# Altium schematic sheet to_sideXtal_energy.SchDoc
size A4
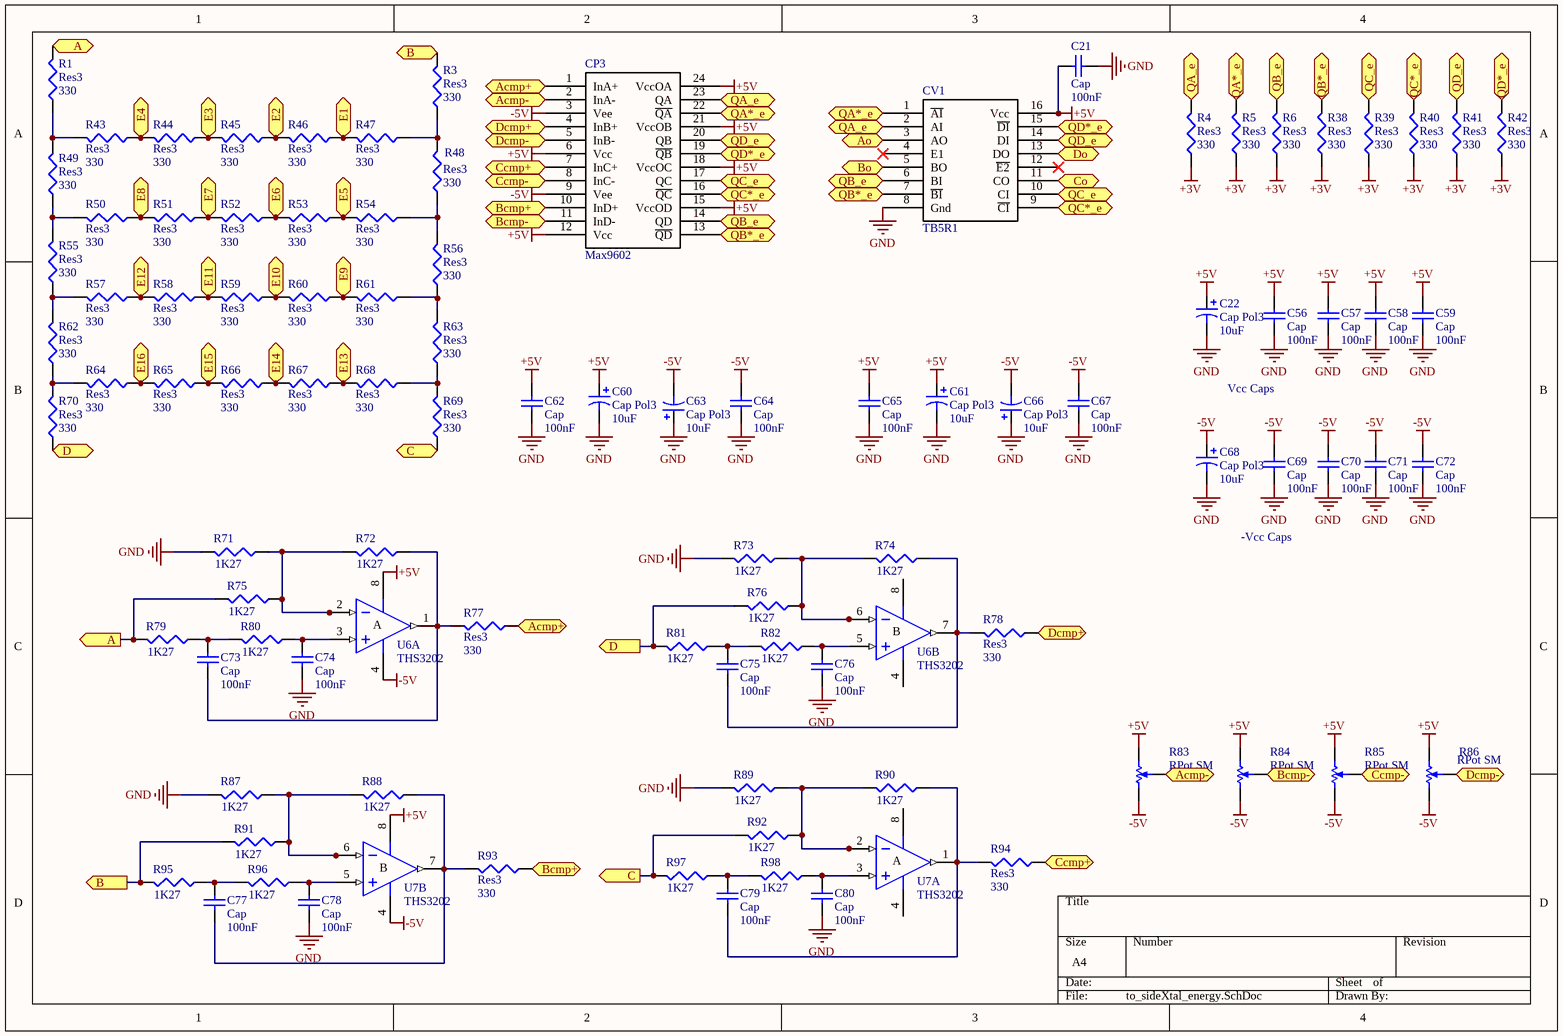
[diagram p0: to_sideXtal_energy.SchDoc]

## Parts
C21  Cap  value 100nF  [1608[0603]]
C22  Cap Pol3  value 10uF  [1608[0603]]
C56  Cap  value 100nF  [0402]
C57  Cap  value 100nF  [0402]
C58  Cap  value 100nF  [0402]
C59  Cap  value 100nF  [0402]
C60  Cap Pol3  value 10uF  [1608[0603]]
C61  Cap Pol3  value 10uF  [1608[0603]]
C62  Cap  value 100nF  [0402]
C63  Cap Pol3  value 10uF  [1608[0603]]
C64  Cap  value 100nF  [0402]
C65  Cap  value 100nF  [0402]
C66  Cap Pol3  value 10uF  [1608[0603]]
C67  Cap  value 100nF  [0402]
C68  Cap Pol3  value 10uF  [1608[0603]]
C69  Cap  value 100nF  [0402]
C70  Cap  value 100nF  [0402]
C71  Cap  value 100nF  [0402]
C72  Cap  value 100nF  [0402]
C73  Cap  value 100nF  [0402]
C74  Cap  value 100nF  [0402]
C75  Cap  value 100nF  [0402]
C76  Cap  value 100nF  [0402]
C77  Cap  value 100nF  [0402]
C78  Cap  value 100nF  [0402]
C79  Cap  value 100nF  [0402]
C80  Cap  value 100nF  [0402]
CP3  Max9602  [TSSOP24]
CV1  TB5R1  [SOIC16_N]
R1  Res3  value 330  [0402]
R3  Res3  value 330  [0402]
R4  Res3  value 330  [0402]
R5  Res3  value 330  [0402]
R6  Res3  value 330  [0402]
R38  Res3  value 330  [0402]
R39  Res3  value 330  [0402]
R40  Res3  value 330  [0402]
R41  Res3  value 330  [0402]
R42  Res3  value 330  [0402]
R43  Res3  value 330  [0402]
R44  Res3  value 330  [0402]
R45  Res3  value 330  [0402]
R46  Res3  value 330  [0402]
R47  Res3  value 330  [0402]
R48  Res3  value 330  [0402]
R49  Res3  value 330  [0402]
R50  Res3  value 330  [0402]
R51  Res3  value 330  [0402]
R52  Res3  value 330  [0402]
R53  Res3  value 330  [0402]
R54  Res3  value 330  [0402]
R55  Res3  value 330  [0402]
R56  Res3  value 330  [0402]
R57  Res3  value 330  [0402]
R58  Res3  value 330  [0402]
R59  Res3  value 330  [0402]
R60  Res3  value 330  [0402]
R61  Res3  value 330  [0402]
R62  Res3  value 330  [0402]
R63  Res3  value 330  [0402]
R64  Res3  value 330  [0402]
R65  Res3  value 330  [0402]
R66  Res3  value 330  [0402]
R67  Res3  value 330  [0402]
R68  Res3  value 330  [0402]
R69  Res3  value 330  [0402]
R70  Res3  value 330  [0402]
R71  value 1K27  [0402]  (hidden comment: Res3)
R72  value 1K27  [0402]  (hidden comment: Res3)
R73  value 1K27  [0402]  (hidden comment: Res3)
R74  value 1K27  [0402]  (hidden comment: Res3)
R75  value 1K27  [0402]  (hidden comment: Res3)
R76  value 1K27  [0402]  (hidden comment: Res3)
R77  Res3  value 330  [0402]
R78  Res3  value 330  [0402]
R79  value 1K27  [0402]  (hidden comment: Res3)
R80  value 1K27  [0402]  (hidden comment: Res3)
R81  value 1K27  [0402]  (hidden comment: Res3)
R82  value 1K27  [0402]  (hidden comment: Res3)
R83  RPot SM  [POT-3MM-SMD]
R84  RPot SM  [POT-3MM-SMD]
R85  RPot SM  [POT-3MM-SMD]
R86  RPot SM  [POT-3MM-SMD]
R87  value 1K27  [0402]  (hidden comment: Res3)
R88  value 1K27  [0402]  (hidden comment: Res3)
R89  value 1K27  [0402]  (hidden comment: Res3)
R90  value 1K27  [0402]  (hidden comment: Res3)
R91  value 1K27  [0402]  (hidden comment: Res3)
R92  value 1K27  [0402]  (hidden comment: Res3)
R93  Res3  value 330  [0402]
R94  Res3  value 330  [0402]
R95  value 1K27  [0402]  (hidden comment: Res3)
R96  value 1K27  [0402]  (hidden comment: Res3)
R97  value 1K27  [0402]  (hidden comment: Res3)
R98  value 1K27  [0402]  (hidden comment: Res3)
U6  THS3202  [R-8D_N]  (parts A,B of 2)
U7  THS3202  [R-8D_N]  (parts A,B of 2)

## Ports
A (out), Acmp+ (out), Acmp- (out), Ao (out), B (out), Bcmp+ (out), Bcmp- (out), Bo (out), C (out), Ccmp+ (out), Ccmp- (out), Co (out), D (out), Dcmp+ (out), Dcmp- (out), Do (out), E1 (out), E2 (out), E3 (out), E4 (out), E5 (out), E6 (out), E7 (out), E8 (out), E9 (out), E10 (out), E11 (out), E12 (out), E13 (out), E14 (out), E15 (out), E16 (out), QA*_e (out), QA_e (out), QB*_e (out), QB_e (out), QC*_e (out), QC_e (out), QD*_e (out), QD_e (out)

## Nets
+3V: R4.1 R5.1 R6.1 R38.1 R39.1 R40.1 R41.1 R42.1
+5V: C21.1 C22.1 C56.2 C57.2 C58.2 C59.2 C60.1 C61.1 C62.1 C65.1 CP3.6(Vcc) CP3.12(Vcc) CP3.15(VccOD) CP3.18(VccOC) CP3.21(VccOB) CP3.24(VccOA) CV1.16(Vcc) R83.CW(+) R84.CW(+) R85.CW(+) R86.CW(+) U6.8(V+) U7.8(V+)
-5V: C63.2 C64.1 C66.2 C67.1 C68.1 C69.2 C70.2 C71.2 C72.2 CP3.3(Vee) CP3.9(Vee) R83.CCW(-) R84.CCW(-) R85.CCW(-) R86.CCW(-) U6.4(V-) U7.4(V-)
GND: C21.2 C22.2 C56.1 C57.1 C58.1 C59.1 C60.2 C61.2 C62.2 C63.1 C64.2 C65.2 C66.1 C67.2 C68.2 C69.1 C70.1 C71.1 C72.1 C74.2 C76.2 C78.2 C80.2 CV1.8(Gnd) R71.2 R73.2 R87.2 R89.2
A: R1.2 R75.2 R79.2 ; port A
Acmp+: CP3.1(InA+) R77.1 ; port Acmp+
Acmp-: CP3.2(InA-) R83.W ; port Acmp-
Ao: CV1.3(AO) ; port Ao
B: R3.2 R91.2 R95.2 ; port B
Bcmp+: CP3.10(InD+) R93.1 ; port Bcmp+
Bcmp-: CP3.11(InD-) R84.W ; port Bcmp-
Bo: CV1.5(BO) ; port Bo
C: R69.1 R92.2 R97.2 ; port C
Ccmp+: CP3.7(InC+) R94.1 ; port Ccmp+
Ccmp-: CP3.8(InC-) R85.W ; port Ccmp-
Co: CV1.11(CO) ; port Co
D: R70.1 R76.2 R81.2 ; port D
Dcmp+: CP3.4(InB+) R78.1 ; port Dcmp+
Dcmp-: CP3.5(InB-) R86.W ; port Dcmp-
Do: CV1.13(DO) ; port Do
E1: R46.1 R47.2 ; port E1
E2: R45.1 R46.2 ; port E2
E3: R44.1 R45.2 ; port E3
E4: R43.1 R44.2 ; port E4
E5: R53.1 R54.2 ; port E5
E6: R52.1 R53.2 ; port E6
E7: R51.1 R52.2 ; port E7
E8: R50.1 R51.2 ; port E8
E9: R60.1 R61.2 ; port E9
E10: R59.1 R60.2 ; port E10
E11: R58.1 R59.2 ; port E11
E12: R57.1 R58.2 ; port E12
E13: R67.1 R68.2 ; port E13
E14: R66.1 R67.2 ; port E14
E15: R65.1 R66.2 ; port E15
E16: R64.1 R65.2 ; port E16
QA*_e: CP3.22(~{QA}) CV1.1(~{AI}) R5.2 ; port QA*_e
QA_e: CP3.23(QA) CV1.2(AI) R4.2 ; port QA_e
QB*_e: CP3.13(~{QD}) CV1.7(~{BI}) R38.2 ; port QB*_e
QB_e: CP3.14(QD) CV1.6(BI) R6.2 ; port QB_e
QC*_e: CP3.16(~{QC}) CV1.9(~{CI}) R40.2 ; port QC*_e
QC_e: CP3.17(QC) CV1.10(CI) R39.2 ; port QC_e
QD*_e: CP3.19(~{QB}) CV1.15(~{DI}) R42.2 ; port QD*_e
QD_e: CP3.20(QB) CV1.14(DI) R41.2 ; port QD_e
NetC73_1: C73.1 R79.1 R80.2
NetC73_2: C73.2 R72.1 R77.2 U6.1(OUT)
NetC74_1: C74.1 R80.1 U6.3(IN+)
NetC75_1: C75.1 R81.1 R82.2
NetC75_2: C75.2 R74.1 R78.2 U6.7(OUT)
NetC76_1: C76.1 R82.1 U6.5(IN+)
NetC77_1: C77.1 R95.1 R96.2
NetC77_2: C77.2 R88.1 R93.2 U7.7(OUT)
NetC78_1: C78.1 R96.1 U7.5(IN+)
NetC79_1: C79.1 R97.1 R98.2
NetC79_2: C79.2 R90.1 R94.2 U7.1(OUT)
NetC80_1: C80.1 R98.1 U7.3(IN+)
NetR1_1: R1.1 R43.2 R49.2
NetR3_1: R3.1 R47.1 R48.2
NetR48_1: R48.1 R54.1 R56.2
NetR49_1: R49.1 R50.2 R55.2
NetR55_1: R55.1 R57.2 R62.2
NetR56_1: R56.1 R61.1 R63.2
NetR62_1: R62.1 R64.2 R70.2
NetR63_1: R63.1 R68.1 R69.2
NetR71_1: R71.1 R72.2 R75.1 U6.2(IN-)
NetR73_1: R73.1 R74.2 R76.1 U6.6(IN-)
NetR87_1: R87.1 R88.2 R91.1 U7.6(IN-)
NetR89_1: R89.1 R90.2 R92.1 U7.2(IN-)

Not connected (* = marked no-connect by the designer): CV1 4(E1)* 12(~{E2})*

## Notes on the sheet
- Vcc Caps
- -Vcc Caps
- (in symbol AD8002AR, part A) A
- (in symbol AD8002AR, part B) B

## Library data of the parts
C21 C56-C59 C62 C64 C65 C67 C69-C80 = Cap: Capacitor; Published: 8-Jun-2000; LatestRevisionDate: 17-Jul-2002; LatestRevisionNote: Re-released for DXP Platform.; PackageReference: RAD-0.3; Publisher: Altium Limited; PackageDescription: Radial Cap, Thru-Hole; 2 Leads; 0.3 in Pin Spacing
C22 C60 C61 C63 C66 C68 = Cap Pol3: Polarized Capacitor (Surface Mount); Published: 8-Jun-2000; LatestRevisionDate: 29-May-2009; LatestRevisionNote: IPC-7351 Footprint Added.; PackageReference: C0805; Publisher: Altium Limited; PackageDescription: Chip Capacitor
R1 R3-R6 R38-R82 R87-R98 = Res3: Resistor; Published: 8-Jun-2000; LatestRevisionDate: 29-May-2009; LatestRevisionNote: IPC-7351 Footprint Added.; PackageReference: J1-0603; Publisher: Altium Limited; PackageDescription: Chip Resistor
R83-R86 = RPot SM: Square Trimming Potentiometer; Published: 17-Dec-2003; DatasheetVersion: Oct-2003; PackageReference: POT4MM-2; Publisher: Altium Limited; PackageDescription: Square Trimming Potentiometer; ComponentLink1Description: Manufacturer Link; ComponentLink1URL: http://bourns.com/2/search.html
U6 U7 = AD8002AR: Dual 600MHz, 50mW Current Feedback Amplifier; Published: 8-Jun-2000; LatestRevisionDate: 13-Apr-2006; LatestRevisionNote: IPC-7351 Footprint Added.; DatasheetVersion: REV. C 1999; PackageVersion: revA; PackageReference: SO-8; Publisher: Altium Limited; PackageDescription: 8-Pin Small Outline Integrated Circuit 1.27 mm Pitch; Code_JEDEC: MS-012-AA; Code_IPC: SOIC127P600-8; ComponentLink1Description: Manufacturer Link; ComponentLink1URL: http://www.analog.com/en/prod/0,,759_786_AD8002%2C00.html; ComponentLink2Description: Datasheet; ComponentLink2URL: http://www.analog.com/UploadedFiles/Data_Sheets/147523773AD8002_d.pdf